# EAGLE design Tayloe Detector v4 (EAGLE 9.1.2)
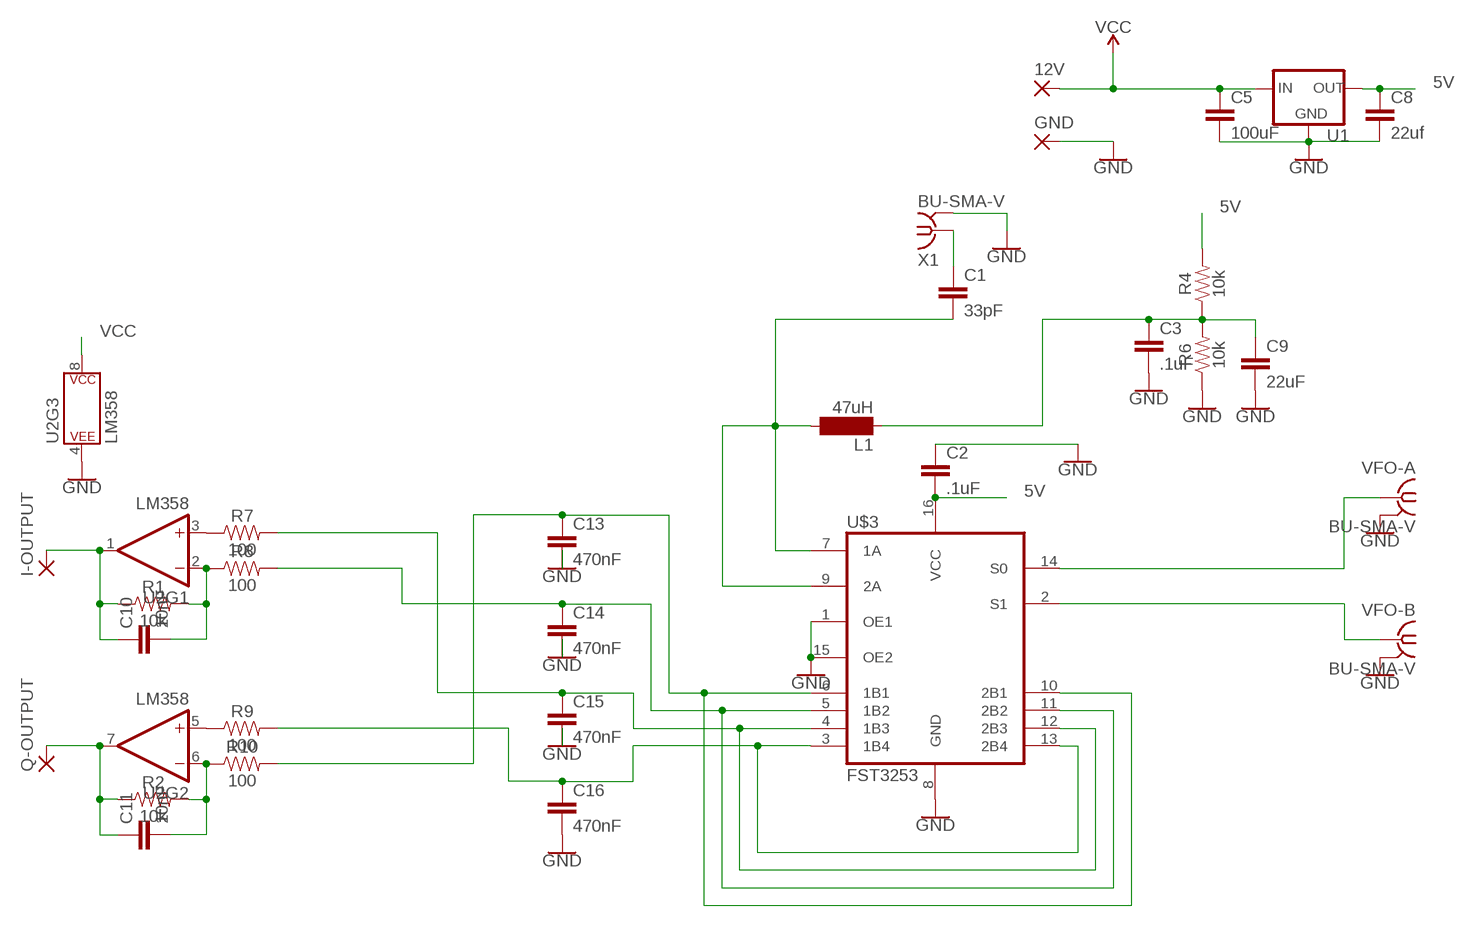
[diagram p0: schematic, sheet 1]

## Parts
12V  3,17/1,1  [3,17/1,1]
C1  33pF  C5/3.5  [C5B3.5]
C2  .1uF  C5/3.5  [C5B3.5]
C3  .1uF  C5/3.5  [C5B3.5]
C5  100uF  C5/3.5  [C5B3.5]
C8  22uf  C5/3.5  [C5B3.5]
C9  22uF  C5/3.5  [C5B3.5]
C10  10nF  C5/3.5  [C5B3.5]
C11  10nF  C5/3.5  [C5B3.5]
C13  470nF  C5/3.5  [C5B3.5]
C14  470nF  C5/3.5  [C5B3.5]
C15  470nF  C5/3.5  [C5B3.5]
C16  470nF  C5/3.5  [C5B3.5]
GND  3,17/1,1  [3,17/1,1]
I-OUTPUT  3,17/1,1  [3,17/1,1]
L1  47uH  BS75  [BS75]
Q-OUTPUT  3,17/1,1  [3,17/1,1]
R1  10k  1KOHM-HORIZ-1/4W-1%  [AXIAL-0.3]
R2  10k  1KOHM-HORIZ-1/4W-1%  [AXIAL-0.3]
R4  10k  1KOHM-HORIZ-1/4W-1%  [AXIAL-0.3]
R6  10k  1KOHM-HORIZ-1/4W-1%  [AXIAL-0.3]
R7  100  1KOHM-HORIZ-1/4W-1%  [AXIAL-0.3]
R8  100  1KOHM-HORIZ-1/4W-1%  [AXIAL-0.3]
R9  100  1KOHM-HORIZ-1/4W-1%  [AXIAL-0.3]
R10  100  1KOHM-HORIZ-1/4W-1%  [AXIAL-0.3]
U1  V_REG_78XXTO-92_UNTESTED  [TO-92]
U2  LM358  [DIP08]
U$3  FST3253  [SO16]
VFO-A  BU-SMA-V  [BU-SMA-V]
VFO-B  BU-SMA-V  [BU-SMA-V]
X1  BU-SMA-V  [BU-SMA-V]

## Nets
5V: C2.2 C8.1 R4.P$2 U1.1(OUT) U$3.16(VCC)
GND: C2.1 C3.2 C5.2 C8.2 C9.2 C13.2 C14.2 C15.2 C16.2 GND.1(P) R6.P$1 U1.2(GND) U2.4(P$V-) U$3.1(OE1) U$3.8(GND) U$3.15(OE2) VFO-A.2 VFO-A.3 VFO-A.4 VFO-A.5 VFO-B.2 VFO-B.3 VFO-B.4 VFO-B.5 X1.2 X1.3 X1.4 X1.5
N$1: C1.1 X1.1
N$2: R7.P$1 U2.3(+IN)
N$3: C3.1 C9.1 L1.1 R4.P$1 R6.P$2
N$5: C1.2 L1.2 U$3.7(1A) U$3.9(2A)
N$6: C10.2 R1.P$2 R8.P$1 U2.2(-IN)
N$8: R9.P$1 U2.5(+IN)
N$10: C10.1 I-OUTPUT.1(P) R1.P$1 U2.1(OUT)
N$11: C14.1 R8.P$2 U$3.5(1B2) U$3.11(2B2)
N$12: C11.2 R2.P$2 R10.P$1 U2.6(-IN)
N$13: C15.1 R7.P$2 U$3.4(1B3) U$3.12(2B3)
N$14: C13.1 R10.P$2 U$3.6(1B1) U$3.10(2B1)
N$15: U$3.14(S0) VFO-A.1
N$16: C11.1 Q-OUTPUT.1(P) R2.P$1 U2.7(OUT)
N$17: U$3.2(S1) VFO-B.1
N$18: C16.1 R9.P$2 U$3.3(1B4) U$3.13(2B4)
VCC: 12V.1(P) C5.1 U1.3(IN) U2.8(P$V+)

## Library data of the parts
12V GND I-OUTPUT Q-OUTPUT = wirepad:3,17/1,1: THROUGH-HOLE PAD
C1-C3 C5 C8-C11 C13-C16 = capacitor-wima:C: CAPACITOR naming: grid - package width
L1 = inductor-neosid:BS: INDUCTOR nominal inductance, magnetically screened; OC_FARNELL: unknown; OC_NEWARK: unknown
R1 R2 R4 R6-R10 = SparkFun-Resistors:1KOHM: 1kΩ resistor A resistor is a passive two-terminal electrical component that implements electrical resistance as a circuit element. Resistors act to reduce current flow, and, at the same time, act to lower voltage levels within circuits. - Wikipedia; PROD_ID: RES-12182; VALUE: 1k
U1 = SparkFun-IC-Power:V_REG_78XX: Voltage Regulator Standard 78xx regulator. IGO (Input Ground Output). Spark Fun Electronics SKU : COM-00107
U2 = SparkFun-IC-Amplifiers:LM358: LM358 Jellybean op-amp Datasheet <http://www.sparkfun.com/datasheets/Components/General/LM358.pdf> SparkFun Products Op-Amp (Thru-Hole) - LM358 <https://www.sparkfun.com/products/9456> (COM-09456); PROD_ID: IC-09172
U$3 = SparkFun-IC-Comms:FST3253: The Fairchild Switch FST3253 is a dual 4:1 high-speed CMOS TTL-compatible multiplexer/demultiplexer bus switch. The low on resistance of the switch allows inputs to be connected to outputs without adding propagation delay or generating additional ground bounce noise. When OE is LOW, S0 and S1 connect the A Port to the selected B Port output. When OE is HIGH, the switch is OPEN and a high-impedance state exists between the two
VFO-A VFO-B X1 = con-coax:BU-SMA-V: FEMALE SMA CONNECTOR Radiall distributor RS 112-3794; OC_FARNELL: unknown; OC_NEWARK: unknown

## Net classes
0 default: width 0.762 mm, drill 0.762 mm, clearance 0.508 mm

## Board
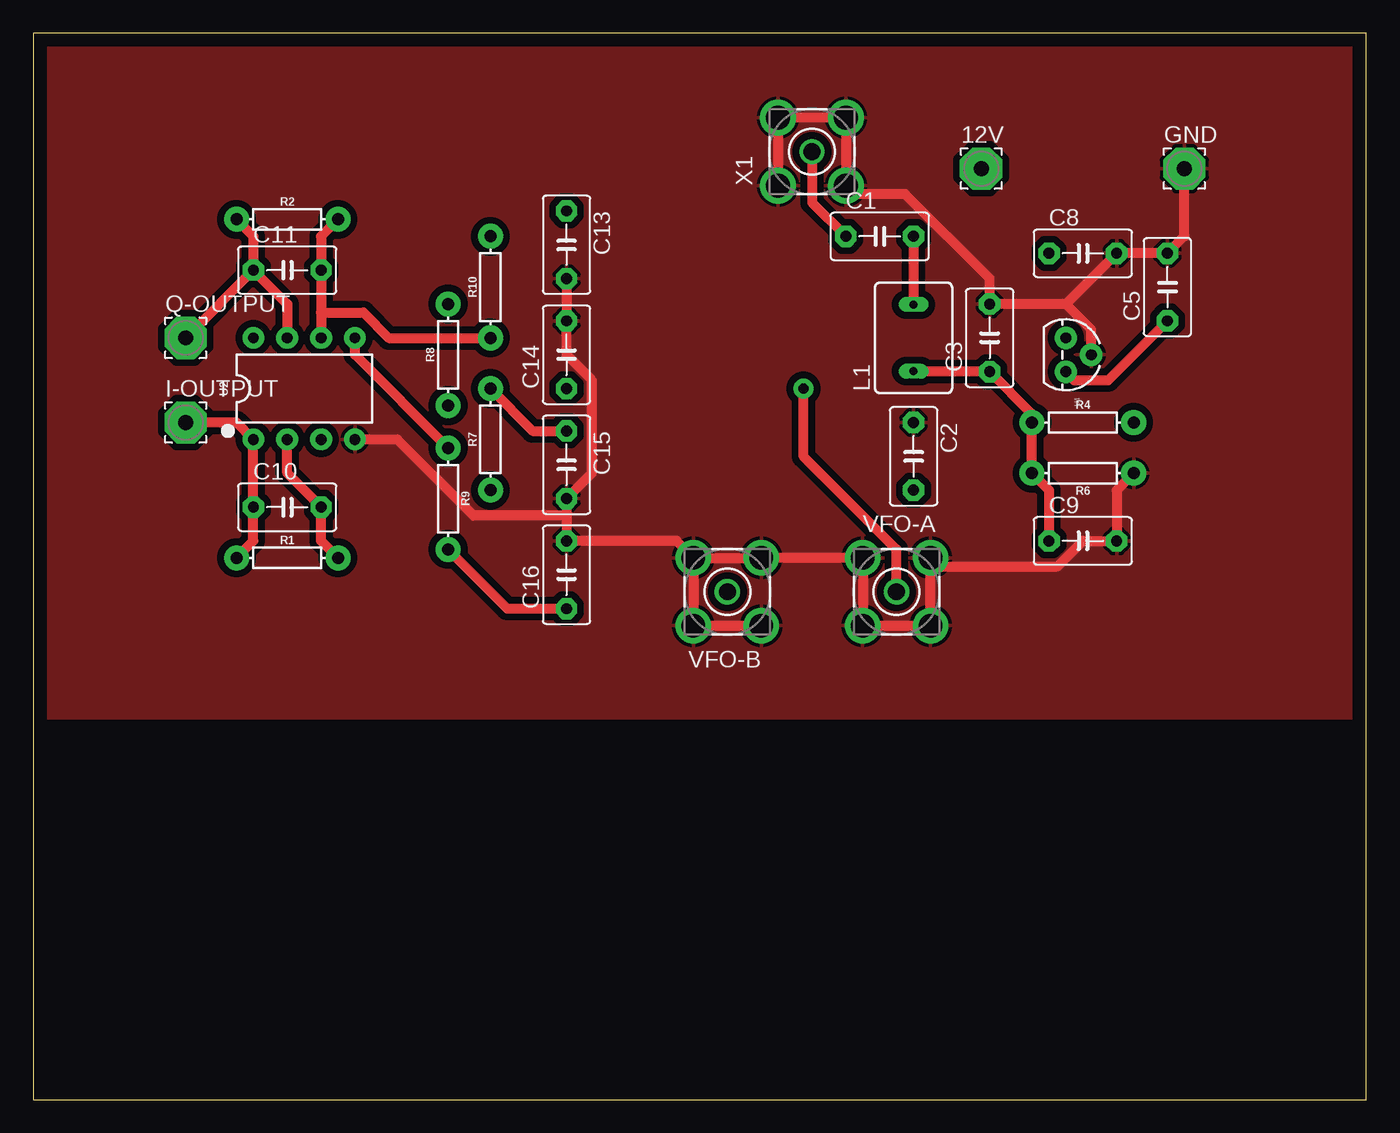
[diagram p1: board, top side]
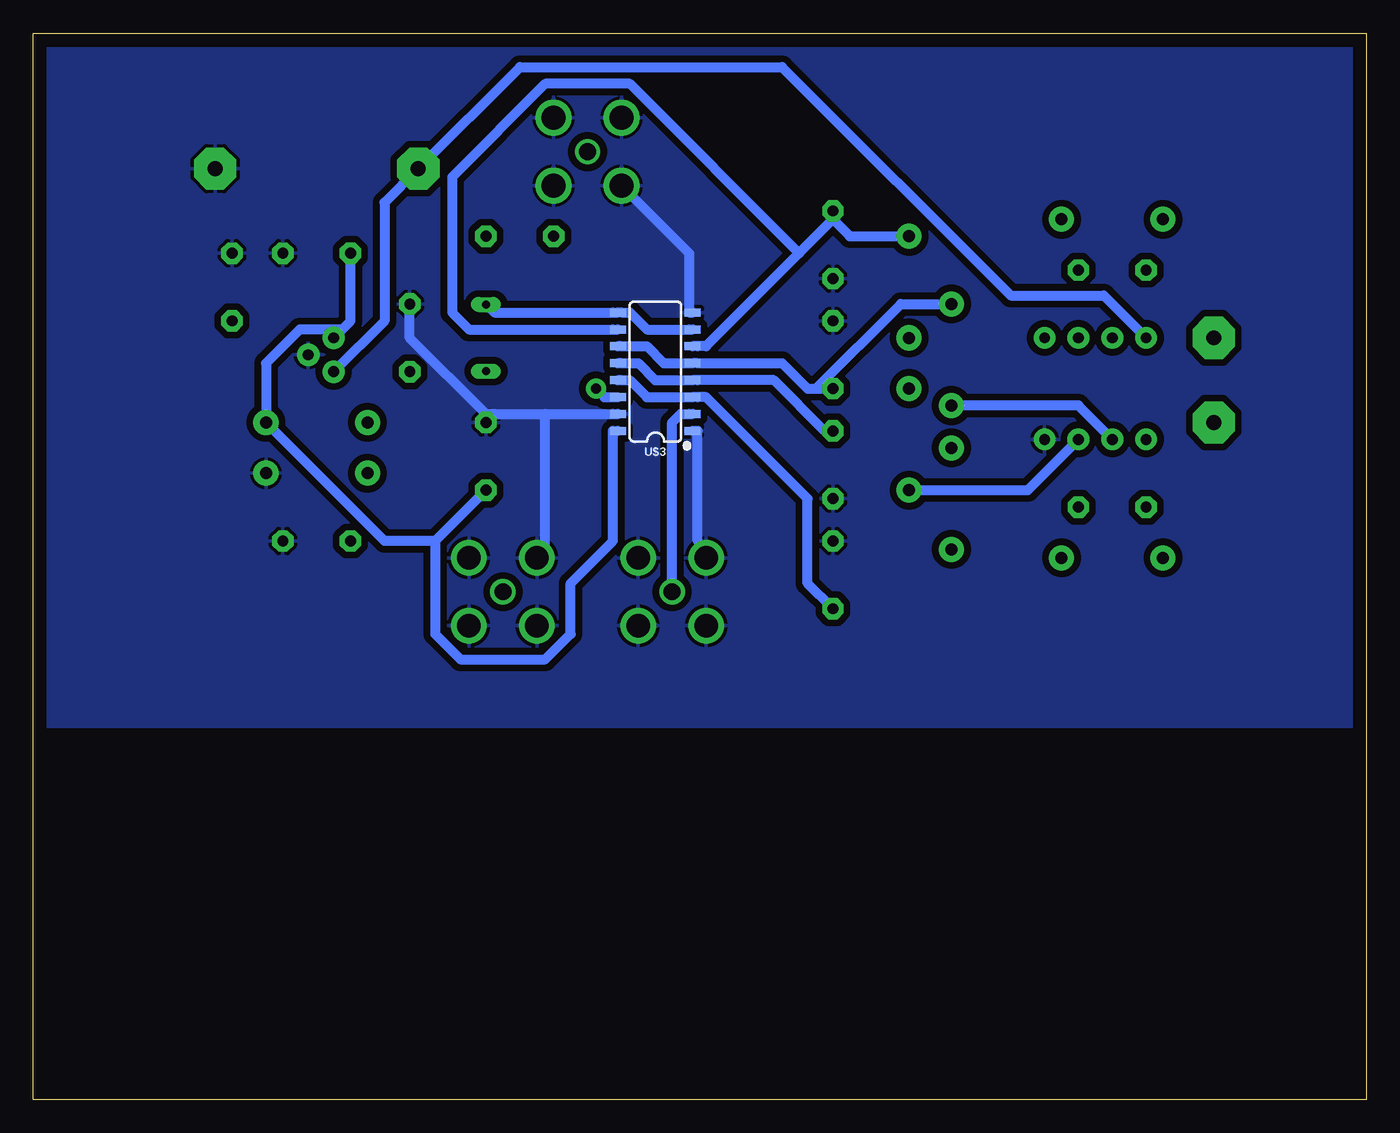
[diagram p2: board, bottom side, seen from below]

Size 100 x 80 mm. Coordinates in mm from the lower left corner, seen from the top.
Outline: 0,0 100,0 100,80 0,80 0,0
Copper layers (1*16): Top 0.035mm / dielectric 1.5mm / Bottom 0.035mm
Design rules "default": minimum track width 6mil, minimum drill 0.35mm, track to track 6mil, track to pad 6mil, pad to pad 6mil, via to via 6mil, smd to smd 6mil, copper to edge 40mil, drill to drill 6mil, minimum pad ring 10mil, minimum via ring 8mil, stop-mask expansion 4mil, vias tented up to drill 0mil, thermal gap 10mil

### Footprints (pad centres in the part's own frame; a part is rotated, then mirrored left to right if it is on the bottom)
3,17/1,1 = drill 1.118 pad 3.175 octagon: 1 0,0
C5B3.5 = drill 0.813 pad 1.6 octagon: 1 -2.54,0; 2 2.54,0
BS75 = drill 0.6 long: 1 -2.5,0; 2 2.5,0
AXIAL-0.3 = drill 0.9 pad 1.88: P$1 -3.81,0; P$2 3.81,0
TO-92 = drill 0.813 pad 1.676: 1 -1.27,0; 2 0,1.905; 3 1.27,0
DIP08 = drill 0.813 pad 1.626: 1 -3.81,-3.81; 2 -1.27,-3.81; 3 1.27,-3.81; 4 3.81,-3.81; 5 3.81,3.81; 6 1.27,3.81; 7 -1.27,3.81; 8 -3.81,3.81
SO16 = smd 0.6 x 1.2: 1 -4.445,-2.8; 2 -3.175,-2.8; 3 -1.905,-2.8; 4 -0.635,-2.8; 5 0.635,-2.8; 6 1.905,-2.8; 7 3.175,-2.8; 8 4.445,-2.8; 9 4.445,2.8; 10 3.175,2.8; 11 1.905,2.8; 12 0.635,2.8; 13 -0.635,2.8; 14 -1.905,2.8; 15 -3.175,2.8; 16 -4.445,2.8
BU-SMA-V = drill 1.27: 1 0,0 | drill 1.778: 2 -2.55,2.55; 3 2.55,2.55; 4 2.55,-2.55; 5 -2.55,-2.55

### Placement (x,y rotation side)
12V  71.12,69.85 0 top
C1  63.5,64.77 0 top
C2  66.04,48.26 270 top
C3  71.75,57.15 90 top
C5  85.09,60.96 90 top
C8  78.74,63.5 0 top
C9  78.74,41.91 0 top
C10  19.05,44.45 0 top
C11  19.05,62.23 0 top
C13  40.01,64.14 270 top
C14  40.01,55.88 90 top
C15  40.01,47.62 270 top
C16  40.01,39.37 90 top
GND  86.36,69.85 0 top
I-OUTPUT  11.43,50.8 0 top
L1  66.04,57.15 90 top
Q-OUTPUT  11.43,57.15 0 top
R1  19.05,40.64 0 top
R2  19.05,66.04 0 top
R4  78.74,50.8 0 top
R6  78.74,46.99 180 top
R7  34.29,49.53 90 top
R8  31.11,55.88 90 top
R9  31.11,45.09 270 top
R10  34.29,60.96 90 top
U1  77.47,55.88 270 top
U2  20.32,53.34 0 top
U$3  53.34,54.61 90 bottom
VFO-A  64.77,38.1 0 top
VFO-B  52.07,38.1 180 top
X1  58.42,71.12 90 top

### Tracks (layer width: path | path; a pad name or v marks a point on that pad's centre or on a via)
5V
  Bottom 0.762: C8.1 76.2,58.42 76.83,57.78 | U1.1 76.83,57.78 | 76.83,57.78 80.01,57.78 82.55,55.24 R4.P$2 73.66,41.91 69.85,41.91 | 69.85,41.91 69.85,34.92 67.94,33.02 61.59,33.02 59.69,34.92 59.69,38.73 56.52,41.91 56.52,50.16 U$3.16 | C2.2 69.85,41.91
GND
  Top 0.762: X1.4 X1.3 | X1.3 | X1.4 | X1.4 X1.5 61.59,67.94 65.41,67.94 71.75,61.59 C3.2 77.47,59.69 | X1.3 X1.2 | 77.47,59.69 79.38,57.78 U1.2 | 77.47,59.69 C8.2 C5.2 86.36,64.77 GND.1 | C13.2 C14.2 40.01,55.88 41.91,53.98 41.91,46.99 C15.2 40.01,43.81 | 40.01,43.81 C16.2 48.26,41.91 48.9,41.27 VFO-B.4 | U2.4 27.3,49.53 33.02,43.81 40.01,43.81 | VFO-B.4 VFO-B.3 | VFO-B.3 | VFO-B.4 | VFO-B.3 VFO-B.2 | VFO-B.4 VFO-B.5 55.24,40.64 61.59,40.64 VFO-A.2 VFO-A.5 | VFO-B.4 | R6.P$1 81.28,45.72 C9.2 78.74,41.91 76.83,40.01 67.31,40.01 | VFO-A.5 | VFO-A.5 VFO-A.4 | VFO-A.4 | VFO-A.4 67.31,40.01 | 67.31,40.01 VFO-A.3 67.31,40.01
  Bottom 0.762: U$3.8 50.8,59.05 50.8,63.5 55.24,67.94 X1.2 | U$3.1 50.16,50.16 50.16,41.91 49.53,41.27 VFO-B.4 | 65.41,51.44 61.59,51.44 | 61.59,51.44 56.52,51.44 U$3.15 | C2.1 65.41,51.44 | 61.59,51.44 61.59,41.27 VFO-A.2 | C3.2 71.75,57.15 66.04,51.44 65.41,51.44
  pour Top: 0,80.01 99.69,80.01 99.69,28.57 0,28.57
  pour Bottom: 0.64,80.01 99.69,80.01 99.69,28.57 100.33,27.94 0,27.94 0,79.38
N$1
  Top 0.762: C1.1 58.42,67.31 X1.1
N$2
  Bottom 0.762: U2.3 25.4,45.72 R7.P$1
N$3
  Top 0.762: L1.1 66.04,54.61 C3.1 74.93,51.44 R4.P$1 R6.P$2 76.2,45.72 C9.1
N$5
  Top 0.762: C1.2 66.04,59.69 L1.2
  Bottom 0.762: U$3.7 50.8,57.78 53.98,57.78 55.24,59.05 55.88,59.05 U$3.9 56.52,59.05 65.41,59.05 66.04,59.69 L1.2
N$6
  Top 0.762: R1.P$2 21.59,41.91 C10.2 19.05,46.99 U2.2
  Bottom 0.762: R8.P$1 21.59,52.07 U2.2
N$8
  Top 0.762: U2.5 24.13,55.88 R9.P$1
N$10
  Top 0.762: R1.P$1 16.51,41.91 C10.1 U2.1 15.24,50.8 I-OUTPUT.1
N$11
  Bottom 0.762: U$3.11 55.88,56.52 53.98,56.52 52.7,55.24 50.8,55.24 U$3.5 50.16,55.24 43.81,55.24 41.91,53.34 41.27,53.34 | 41.27,53.34 C14.1 | R8.P$2 34.92,59.69 41.27,53.34
N$12
  Top 0.762: R2.P$2 21.59,64.77 C11.2 21.59,59.05 | 21.59,59.05 U2.6 | R10.P$1 26.67,57.15 24.77,59.05 21.59,59.05
N$13
  Top 0.762: C15.1 37.47,50.16 R7.P$2
  Bottom 0.762: U$3.12 55.88,55.24 54.61,55.24 53.34,53.98 50.8,53.98 U$3.4 50.16,53.98 44.45,53.98 40.64,50.16 C15.1
N$14
  Bottom 0.762: 40.01,66.04 42.55,63.5 | 42.55,63.5 49.53,56.52 50.16,56.52 U$3.6 | 40.01,66.04 C13.1 40.01,66.04 | 42.55,63.5 55.24,76.2 61.59,76.2 68.58,69.22 68.58,59.05 67.31,57.78 56.52,57.78 U$3.10 | R10.P$2 38.73,64.77 40.01,66.04
N$15  (via drill 0.76 pad 1.52)
  Top 0.762: v57.78,53.34 57.78,48.26 64.77,41.27 VFO-A.1
  Bottom 0.762: v57.78,53.34 57.15,52.7 56.52,52.7 U$3.14
N$16
  Top 0.762: C11.1 16.51,64.77 R2.P$1 | U2.7 19.05,59.69 C11.1 | C11.1 Q-OUTPUT.1
N$17
  Bottom 0.762: VFO-B.1 52.07,50.8 51.44,51.44 50.8,51.44 U$3.2
N$18
  Top 0.762: C16.1 35.56,36.83 R9.P$2
  Bottom 0.762: U$3.13 55.88,53.98 55.24,53.98 53.98,52.7 50.8,52.7 U$3.3 50.16,52.7 49.53,52.7 41.91,45.09 41.91,38.73 C16.1
VCC
  Top 0.762: C5.1 80.64,53.98 78.11,53.98 U1.3
  Bottom 0.762: U2.8 19.68,60.33 26.67,60.33 43.81,77.47 63.5,77.47 12V.1 73.66,67.31 73.66,58.42 U1.3